# Altium schematic sheet controller_sch.SchDoc: controller sch
size 393 x 281 mm; Author: SAH; CompanyName: C3; DrawnBy: SAH; Engineer: SAH; DocumentNumber: 01
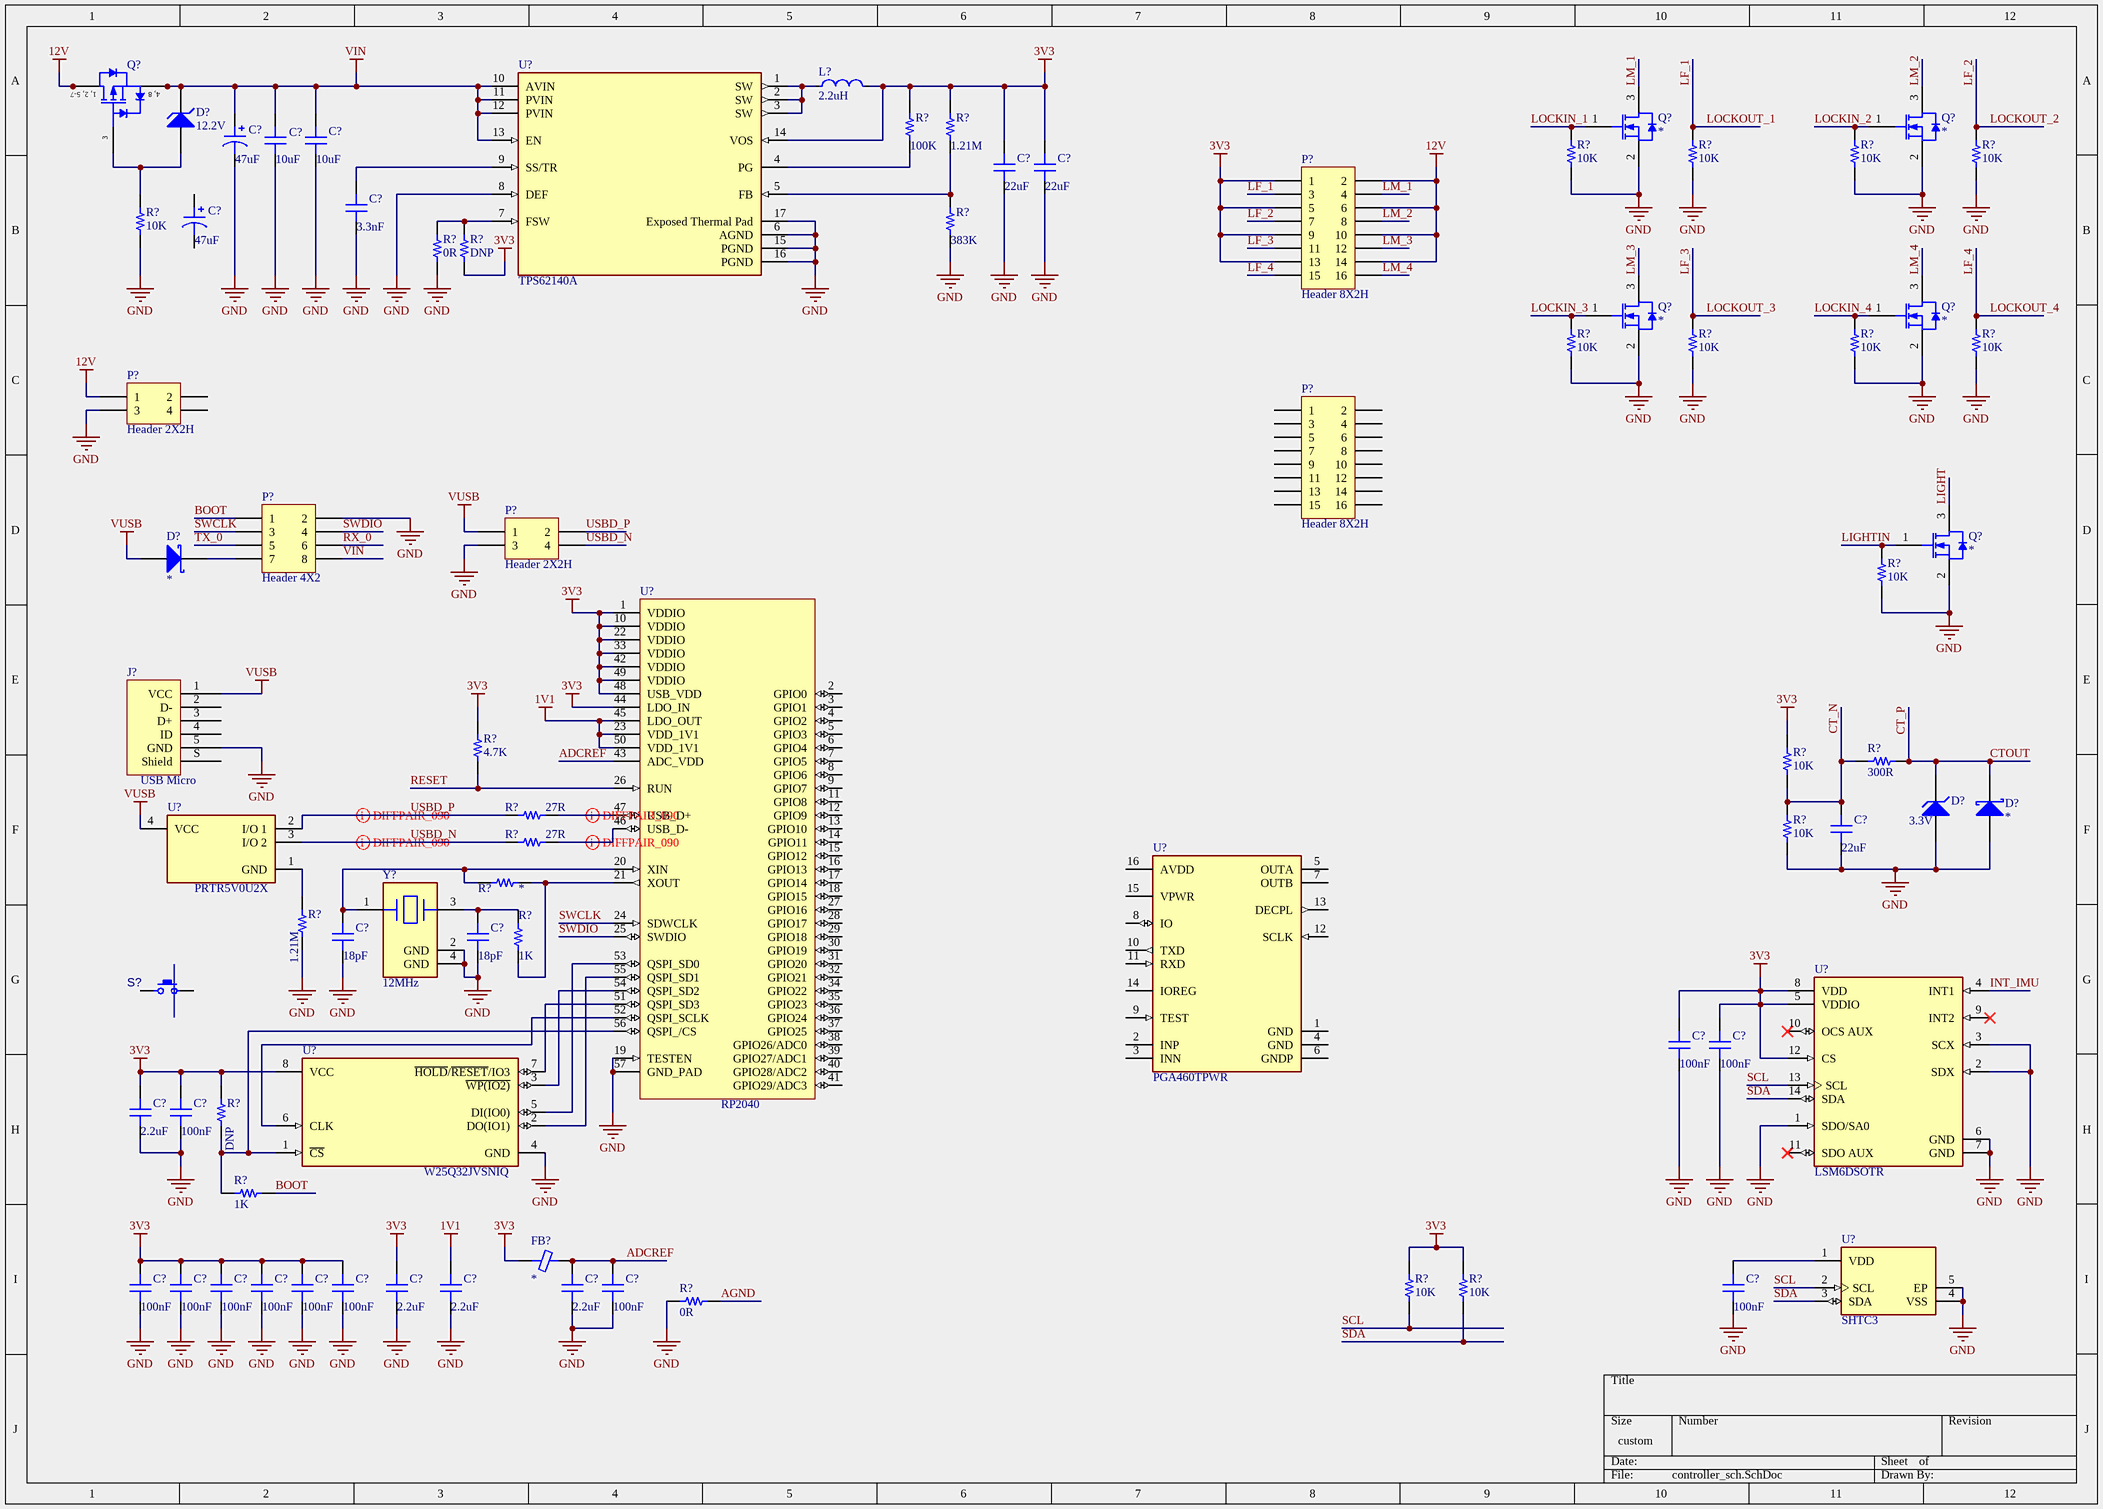
[diagram p0: controller_sch.SchDoc]

## Parts
(Parts that share a designator on the sheet are numbered #1, #2 ... from top to bottom, then left to right.)
C?#1  47uF  [CAP POL 2917_7343]
C?#2  10uF  [CAP 1210_3225 - 2.0MM]
C?#3  10uF  [CAP 1210_3225 - 2.0MM]
C?#4  22uF  [CAP 0805_2012]
C?#5  22uF  [CAP 0805_2012]
C?#6  3.3nF  [CAP 0603_1608]
C?#7  47uF  [CAP ALSMD 6.3MM H7.7MM]
C?#8  22uF  [CAP 0805_2012]
C?#9  18pF  [CAP 0603_1608]
C?#10  18pF  [CAP 0603_1608]
C?#11  100nF  [CAP 0603_1608]
C?#12  100nF  [CAP 0603_1608]
C?#13  2.2uF  [CAP 0603_1608]
C?#14  100nF  [CAP 0603_1608]
C?#15  100nF  [CAP 0603_1608]
C?#16  100nF  [CAP 0603_1608]
C?#17  100nF  [CAP 0603_1608]
C?#18  100nF  [CAP 0603_1608]
C?#19  100nF  [CAP 0603_1608]
C?#20  100nF  [CAP 0603_1608]
C?#21  2.2uF  [CAP 0603_1608]
C?#22  2.2uF  [CAP 0603_1608]
C?#23  2.2uF  [CAP 0603_1608]
C?#24  100nF  [CAP 0603_1608]
C?#25  100nF  [CAP 0603_1608]
D?#1  12.2V  [SOD-123-2]
D?#2  *  [Nexperia_SOD123W_0]
D?#3  3.3V  [ON_Semi_SOD-123F_0]
D?#4  *  [ON_Semi_SOD-123F_0]
FB?  *  [Murata_BLM18-0_15-t0_8_MFG]
J?  USB Micro  [FCI USB 10118193-0001LF]
L?  2.2uH  [Coilcraft_XFL4020_MFG]
P?#1  Header 8X2H  [Molex_2x8]
P?#2  Header 2X2H  [Molex_2x2]
P?#3  Header 8X2H  [Molex_2x8]
P?#4  Header 4X2  [HDR2X4]
P?#5  Header 2X2H  [Molex_2x2]
Q?#1  *  [ON SEMI SOT-23-3]
Q?#2  *  [ON SEMI SOT-23-3]
Q?#3  PMPB29XPE,115  [NXP-SOT1220_N]  (value not drawn)
Q?#4  *  [ON SEMI SOT-23-3]
Q?#5  *  [ON SEMI SOT-23-3]
Q?#6  *  [ON SEMI SOT-23-3]
R?#1  100K  [RES 0603_1608]
R?#2  1.21M  [RES 0603_1608]
R?#3  10K  [RES 0603_1608]
R?#4  10K  [RES 0603_1608]
R?#5  10K  [RES 0603_1608]
R?#6  10K  [RES 0603_1608]
R?#7  10K  [RES 0603_1608]
R?#8  383K  [RES 0603_1608]
R?#9  0R  [RES 0603_1608]
R?#10  DNP  [RES 0603_1608]
R?#11  10K  [RES 0603_1608]
R?#12  10K  [RES 0603_1608]
R?#13  10K  [RES 0603_1608]
R?#14  10K  [RES 0603_1608]
R?#15  10K  [RES 0603_1608]
R?#16  4.7K  [RES 0603_1608]
R?#17  10K  [RES 0603_1608]
R?#18  300R  [RES 1206_3216]
R?#19  27R  [RES 0603_1608]
R?#20  10K  [RES 0603_1608]
R?#21  27R  [RES 0603_1608]
R?#22  *  [RES 0603_1608]
R?#23  1.21M  [RES 0603_1608]
R?#24  1K  [RES 0603_1608]
R?#25  DNP  [RES 0603_1608]
R?#26  1K  [RES 0603_1608]
R?#27  10K  [RES 0603_1608]
R?#28  10K  [RES 0603_1608]
R?#29  0R  [RES 0603_1608]
S?  SPST-NO 4 PIN  [C&K_Components_PTS810_SJG_250_SMTR_LFS_MFG]  (value not drawn)
U?#1  TPS62140A  [Texas_Instruments_RGT0016C_MFG]
U?#2  RP2040  [RP2040-Footprint-1]
U?#3  PRTR5V0U2X  [Nexperia_SOT143B_MFG]
U?#4  PGA460TPWR  [PW0016A_MFG]
U?#5  LSM6DSOTR  [STMicroelectronics_LGA-14L-DM00249496_MFG]
U?#6  W25Q32JVSNIQ  [SPANSION SOIC-8 150mil Wide]
U?#7  SHTC3  [Sensirion_0_MFG]
Y?  value 12MHz  [Abracon_ABM8G_MFG]

## Nets
1V1: C?#22.1 U?#2.23(VDD_1V1) U?#2.45(LDO_OUT) U?#2.50(VDD_1V1)
3V3: C?#4.1 C?#5.1 C?#11.1 C?#12.1 C?#13.1 C?#14.1 C?#15.1 C?#16.1 C?#17.1 C?#18.1 C?#19.1 C?#20.1 C?#21.1 FB?.1 L?.2 P?#1.1 P?#1.5 P?#1.9 P?#1.13 R?#1.1 R?#2.1 R?#10.2 R?#16.2 R?#17.2 R?#25.1 R?#27.1 R?#28.1 U?#1.14(VOS) U?#2.1(VDDIO) U?#2.10(VDDIO) U?#2.22(VDDIO) U?#2.33(VDDIO) U?#2.42(VDDIO) U?#2.44(LDO_IN) U?#2.48(USB_VDD) U?#2.49(VDDIO) U?#5.5(VDDIO) U?#5.8(VDD) U?#5.12(CS) U?#6.8(VCC)
12V: P?#1.2 P?#1.6 P?#1.10 P?#1.14 P?#2.1 Q?#3.1(D) Q?#3.2(D) Q?#3.5(D) Q?#3.6(D) Q?#3.7(D)
GND: C?#1.2 C?#2.2 C?#3.2 C?#4.2 C?#5.2 C?#6.2 C?#8.2 C?#9.2 C?#10.2 C?#11.2 C?#12.2 C?#13.2 C?#14.2 C?#15.2 C?#16.2 C?#17.2 C?#18.2 C?#19.2 C?#20.2 C?#21.2 C?#22.2 C?#23.2 C?#24.2 C?#25.2 D?#3.2(A) D?#4.2(A) J?.5(GND) P?#2.3 P?#4.2 P?#5.3 Q?#1.2(S) Q?#2.2(S) Q?#4.2(S) Q?#5.2(S) Q?#6.2(S) R?#3.2 R?#4.2 R?#5.2 R?#6.2 R?#7.2 R?#8.2 R?#9.2 R?#11.2 R?#12.2 R?#13.2 R?#14.2 R?#15.2 R?#20.1 R?#23.2 R?#29.1 U?#1.6(AGND) U?#1.8(DEF) U?#1.15(PGND) U?#1.16(PGND) U?#1.17(Exposed_Thermal_Pad) U?#2.19(TESTEN) U?#2.57(GND_PAD) U?#5.1(SDO/SA0) U?#5.2(SDX) U?#5.3(SCX) U?#5.6(GND) U?#5.7(GND) U?#6.4(GND) U?#7.4(VSS) U?#7.5(EP) Y?.2(GND) Y?.4(GND)
VIN: C?#1.1 C?#2.1 C?#3.1 D?#1.1(K) P?#4.8 Q?#3.4(S) Q?#3.8(S) U?#1.10(AVIN) U?#1.11(PVIN) U?#1.12(PVIN) U?#1.13(EN)
VUSB: D?#2.2(A) J?.1(VCC) P?#5.1 U?#3.4(VCC)
ADCREF: C?#23.1 C?#24.1 FB?.2 U?#2.43(ADC_VDD)
AGND: R?#29.2
BOOT: P?#4.1 R?#26.1
CT_N: C?#8.1 R?#17.1 R?#18.2 R?#20.2
CT_P: D?#3.1(K) D?#4.1(K) R?#18.1  [also labelled CTOUT]
INT_IMU: U?#5.4(INT1)
LF_1: P?#1.3 R?#4.1  [also labelled LOCKOUT_1]
LF_2: P?#1.7 R?#6.1  [also labelled LOCKOUT_2]
LF_3: P?#1.11 R?#12.1  [also labelled LOCKOUT_3]
LF_4: P?#1.15 R?#14.1  [also labelled LOCKOUT_4]
LIGHT: Q?#6.3(D)
LIGHTIN: Q?#6.1(G) R?#15.1
LM_1: P?#1.4 Q?#1.3(D)
LM_2: P?#1.8 Q?#2.3(D)
LM_3: P?#1.12 Q?#4.3(D)
LM_4: P?#1.16 Q?#5.3(D)
LOCKIN_1: Q?#1.1(G) R?#3.1
LOCKIN_2: Q?#2.1(G) R?#5.1
LOCKIN_3: Q?#4.1(G) R?#11.1
LOCKIN_4: Q?#5.1(G) R?#13.1
RESET: R?#16.1 U?#2.26(RUN)
RX_0: P?#4.6
SCL: R?#27.2 U?#5.13(SCL) U?#7.2(SCL)
SDA: R?#28.2 U?#5.14(SDA) U?#7.3(SDA)
SWCLK: P?#4.3 U?#2.24(SDWCLK)
SWDIO: P?#4.4 U?#2.25(SWDIO)
TX_0: P?#4.5
USBD_N: P?#5.4 R?#21.1 U?#3.3(I/O_2)
USBD_P: P?#5.2 R?#19.1 U?#3.2(I/O_1)
NetC?#6_1: C?#6.1 U?#1.9(SS/TR)
NetC?#9_1: C?#9.1 R?#22.1 U?#2.20(XIN) Y?.1
NetC?#10_1: C?#10.1 R?#24.1 Y?.3
NetC?#25_1: C?#25.1 U?#7.1(VDD)
NetD?#1_2: D?#1.2(A) Q?#3.3(G) R?#7.1
NetD?#2_1: D?#2.1(K) P?#4.7
NetL?_1: L?.1 U?#1.1(SW) U?#1.2(SW) U?#1.3(SW)
NetR?#1_2: R?#1.2 U?#1.4(PG)
NetR?#2_2: R?#2.2 R?#8.1 U?#1.5(FB)
NetR?#9_1: R?#9.1 R?#10.1 U?#1.7(FSW)
NetR?#19_2: R?#19.2 U?#2.47(USB_D+)
NetR?#21_2: R?#21.2 U?#2.46(USB_D-)
NetR?#22_2: R?#22.2 R?#24.2 U?#2.21(XOUT)
NetR?#23_1: R?#23.1 U?#3.1(GND)
NetR?#25_2: R?#25.2 R?#26.2 U?#2.56(QSPI_/CS) U?#6.1(~{CS})
NetS?_1: S?.1(P1) S?.2(P2)
NetS?_3: S?.3(P3) S?.4(P4)
NetU?#2_51: U?#2.51(QSPI_SD3) U?#6.7(~{HOLD}/~{RESET}/IO3)
NetU?#2_52: U?#2.52(QSPI_SCLK) U?#6.6(CLK)
NetU?#2_53: U?#2.53(QSPI_SD0) U?#6.5(DI(IO0))
NetU?#2_54: U?#2.54(QSPI_SD2) U?#6.3(~{WP(IO2)})
NetU?#2_55: U?#2.55(QSPI_SD1) U?#6.2(DO(IO1))

Not connected (* = marked no-connect by the designer): C?#7 1 2; J? 2(D-) 3(D+) 4(ID) S(Shield); P?#2 2 4; P?#3 1 2 3 4 5 6 7 8 9 10 11 12 13 14 15 16; U?#2 2(GPIO0) 3(GPIO1) 4(GPIO2) 5(GPIO3) 6(GPIO4) 7(GPIO5) 8(GPIO6) 9(GPIO7) 11(GPIO8) 12(GPIO9) 13(GPIO10) 14(GPIO11) 15(GPIO12) 16(GPIO13) 17(GPIO14) 18(GPIO15) 27(GPIO16) 28(GPIO17) 29(GPIO18) 30(GPIO19) 31(GPIO20) 32(GPIO21) 34(GPIO22) 35(GPIO23) 36(GPIO24) 37(GPIO25) 38(GPIO26/ADC0) 39(GPIO27/ADC1) 40(GPIO28/ADC2) 41(GPIO29/ADC3); U?#4 1(GND) 2(INP) 3(INN) 4(GND) 5(OUTA) 6(GNDP) 7(OUTB) 8(IO) 9(TEST) 10(TXD) 11(RXD) 12(SCLK) 13(DECPL) 14(IOREG) 15(VPWR) 16(AVDD); U?#5 9(INT2)* 10(OCS_AUX)* 11(SDO_AUX)*

## Layout directives
differential pair; differential pair class DIFFPAIR_090; rule Differential Pairs Routing [Pref Gap = 0.153mm    Min Gap  = 0.153mm    Max Gap  = 0.153mmPref Width = 0.75mm    Min Width  = 0.75mm    Max Width  = 0.75mm]: USBD_P
differential pair; differential pair class DIFFPAIR_091; rule Differential Pairs Routing [Pref Gap = 0.153mm    Min Gap  = 0.153mm    Max Gap  = 0.153mmPref Width = 0.75mm    Min Width  = 0.75mm    Max Width  = 0.75mm]: USBD_N
differential pair; differential pair class DIFFPAIR_092; rule Differential Pairs Routing [Pref Gap = 0.153mm    Min Gap  = 0.153mm    Max Gap  = 0.153mmPref Width = 0.75mm    Min Width  = 0.75mm    Max Width  = 0.75mm]: NetR?#21_2
differential pair; differential pair class DIFFPAIR_093; rule Differential Pairs Routing [Pref Gap = 0.153mm    Min Gap  = 0.153mm    Max Gap  = 0.153mmPref Width = 0.75mm    Min Width  = 0.75mm    Max Width  = 0.75mm]: NetR?#19_2

## Notes on the sheet
- Title
- Size:
- Date:
- A3
- Number:
- Time:
- Revision:
- Sheet
- of
- File:
- (in symbol Mosfet-P-2) 1, 2, 5-7; 4, 8

## Library data of the parts
C?#1 C?#7 = Polarised Capacitor: SMT Polarised Capacitor; MF: *; MP: *; Value: 47uF
C?#2-C?#6 C?#8-C?#25 = Capacitor: SMT Capacitor; MF: *; MP: *
  C?#2 C?#3: Value: 10uF
  C?#4 C?#5 C?#8: Value: 22uF
  C?#6: Value: 3.3nF
  C?#9 C?#10: Value: 18pF
  C?#11 C?#12 C?#14-C?#20 C?#24 C?#25: Value: 100nF
  C?#13 C?#21-C?#23: Value: 2.2uF
D?#1 = Zener Diode: Zener Voltage Regulator; Manufacturer: On Semiconductor; Packing: Tape and Reel; P Max (W): 0.5; VZ Typ (V): 4.7; ComponentLink1Description: Manufacturer URL; ComponentLink2Description: Datasheet; DatasheetVersion: Rev. 12; ComponentLink3URL: http://www.onsemi.com/pub_link/Collateral/425-04.PDF; ComponentLink3Description: Package Specification; ComponentLink1URL: http://www.onsemi.com/; ComponentLink2URL: http://www.onsemi.com/pub_link/Collateral/MMSZ5221BT1-D.PDF; PackageVersion: Rev. G, 10/2009; PackageReference: SOD-123-2-425-04; PackageDescription: 2-Pin SOD, Body 1.6 x 2.69 mm; Mounting Technology: Surface Mount; RoHS: Pb-Free; MF: *; MP: *; Value: 12.2V
D?#2 = Schottky Diode: Schottky Barrier Rectifier, 40 V Maximum DC Blocking Voltage, -65 to 125 degC, 2-Pin SMA Case, RoHS; ComponentLink1Description: Manufacturer URL; ComponentLink2Description: Datasheet; MF: *; ComponentLink3URL: http://www.vishay.com/docs/88746/ss12.pdf; ComponentLink3Description: Package Specification; ComponentLink1URL: http://www.vishay.com/; ComponentLink2URL: http://www.vishay.com/docs/88746/ss12.pdf; MP: *; Value: *
D?#3 = Zener Diode: Zener Voltage Regulator; Manufacturer: On Semiconductor; Packing: Tape and Reel; P Max (W): 0.5; VZ Typ (V): 4.7; MF: Nexperia; MP: NZH3V3A,115; ComponentLink1Description: Manufacturer URL; ComponentLink2Description: Datasheet; DatasheetVersion: Rev. 12; ComponentLink3URL: http://www.onsemi.com/pub_link/Collateral/425-04.PDF; ComponentLink3Description: Package Specification; ComponentLink1URL: http://www.onsemi.com/; ComponentLink2URL: http://www.onsemi.com/pub_link/Collateral/MMSZ5221BT1-D.PDF; PackageVersion: Rev. G, 10/2009; PackageReference: SOD-123-2-425-04; PackageDescription: 2-Pin SOD, Body 1.6 x 2.69 mm; Mounting Technology: Surface Mount; RoHS: Pb-Free; Value: 3.3V
D?#4 = Schottky Diode: Schottky Barrier Rectifier, 40 V Maximum DC Blocking Voltage, -65 to 125 degC, 2-Pin SMA Case, RoHS; MF: Nexperia; MP: PMEG2010AEH,115; ComponentLink1Description: Manufacturer URL; ComponentLink2Description: Datasheet; ComponentLink3URL: http://www.vishay.com/docs/88746/ss12.pdf; ComponentLink3Description: Package Specification; ComponentLink1URL: http://www.vishay.com/; ComponentLink2URL: http://www.vishay.com/docs/88746/ss12.pdf; Value: *
FB? = Ferrite Chip: SMT Ferrite Chip; MF: *; MP: *; Value: *
J? = USB 2.0 Type B Micro: MP: 10118194-0001LF; MF: Amphenol FCI
L? = Inductor_sm: Fixed Inductors 2.2uH 20% High Temp AEC-Q200; MF: *; MP: *; Value: 2.2uH
P?#1 P?#3 = Header 8X2H: Header, 8-Pin, Dual row, Right Angle; LatestRevisionDate: 17-Jul-2002; LatestRevisionNote: Re-released for DXP Platform.; Publisher: Altium Limited
P?#2 P?#5 = Header 2X2H: Header, 2-Pin, Dual row, Right Angle; LatestRevisionDate: 17-Jul-2002; LatestRevisionNote: Re-released for DXP Platform.; Publisher: Altium Limited
P?#4 = Header 4X2: Header, 4-Pin, Dual row; LatestRevisionDate: 17-Jul-2002; LatestRevisionNote: Re-released for DXP Platform.; Publisher: Altium Limited
Q?#1 Q?#2 Q?#4-Q?#6 = Mosfet-N: N-Channel Enhancement Mode MOS Transistor, 30 V, 0.85 A, 3-Pin SOT23, Tape and Reel; Coss [typ] (pF): 27; Ciss [typ] (pF): 83; Channel Type: N; Packing: Tape & Reel; ID [max] (A): 0.85; VDS [max] (V): 30; ComponentLink1Description: Manufacturer URL; ComponentLink2Description: Datasheet; ComponentLink3Description: Package Specification; ComponentLink3URL: http://www.nxp.com/documents/outline_drawing/sot023_po.pdf; ComponentLink1URL: http://www.nxp.com/; ComponentLink2URL: http://www.nxp.com/documents/data_sheet/BSH103.pdf; PackageReference: SOT23; Code_JEDEC: TO-236AB; Mounting Technology: Surface Mount; PackageDescription: 3-Pin Small Outline Transistor Package, Body 2.9 x 1.3 mm, Pitch 0.95 mm; PackageVersion: 06-03-16, 03/2006; MF: *; MP: *; Value: *
Q?#3 = Mosfet-P-2: Single P-Channel Trench MOSFET, -20 V, -5 A, -55 to 150 degC, 8-Pin SOT1220, Reel; Ciss [typ] (pF): 2970; Coss [typ] (pF): 245; VGSth [typ] (V): -0.68; Channel Type: P; MF: NXP Semiconductors; ComponentLink1Description: Manufacturer URL; ComponentLink2Description: Datasheet; MP: PMPB29XPE,115; DatasheetVersion: Rev. 1; ComponentLink3URL: http://www.nxp.com/documents/outline_drawing/sot1220_po.pdf; ComponentLink1URL: http://www.nxp.com/; ComponentLink2URL: http://www.nxp.com/documents/data_sheet/PMPB29XPE.pdf; PackageReference: SOT1220; ID [max] (A): -5; Packing: Reel; ComponentLink3Description: Package Specification; Mounting Technology: Surface Mount; VDS [max] (V): -20; PackageDescription: 6-Pin Small Outline No-Lead, Body 2 x 2 mm, Pitch 0.65 mm; PackageVersion: 12-04-30, 04/2012; Value: PMPB29XPE,115
R?#1-R?#29 = Resistor: SMT Resistor; MF: *; MP: *
  R?#1: Value: 100K
  R?#2 R?#23: Value: 1.21M
  R?#3-R?#7 R?#11-R?#15 R?#17 R?#20 R?#27 R?#28: Value: 10K
  R?#8: Value: 383K
  R?#9 R?#29: Value: 0R
  R?#10 R?#25: Value: DNP
  R?#16: Value: 4.7K
  R?#18: Value: 300R
  R?#19 R?#21: Value: 27R
  R?#22: Value: *
  R?#24 R?#26: Value: 1K
S? = SPST-NO 4 PIN: SWITCH, PUSH BUTTON, TACTILE, SMD, SPST; MANF: OMRON; DESC: DESCRIPTION; MANF_P#: B3U-1000P; VALUE: PUSHBUTTON; ASSEMBLY: ASSEMBLY; PARAM: PARAM; PRICE: 1$
U?#1 = TPS62140A: Switching Voltage Regulators 3-V to 17-V, 2-A, high-efficiency and low IQ buck converter 3mm x 3mm QFN package; MF: Texas Instruments; MP: TPS62140ARGTT
U?#2 = RP2040: ARM® Cortex®-M0+ series Microcontroller IC 32-Bit Dual-Core 133MHz 16MB (16M x 8) FLASH 56-QFN (7x7); MF: Raspberry Pi; MP: RP2040TR13
U?#3 = PRTR5V0U2X: IC TVS DIODE 5.5VWM SOT143B; MF: Nexperia; helpURL: https://upverter.com/upn/revision/7499e15ef6437a79/; ComponentLink2Description: Datasheet; Temperature: −40°C to +85°C; Package: SOT143B; Supplier 2: Mouser; Supplier 1: Digi-Key; ComponentLink1URL: https://upverter.com/upn/revision/7499e15ef6437a79/; Supplier Part Number 2: 771-PRTR5V0U2X-T/R; Supplier Part Number 1: 1727-3884-1-ND; ComponentLink1Description: Upverter; ComponentLink2URL: https://assets.nexperia.com/documents/data-sheet/PRTR5V0U2X.pdf; RoHS: TRUE; Mouser Part Number: 771-PRTR5V0U2X-T/R; Digikey Description: IC TVS DIODE 5.5VWM SOT143B; Digikey Part Number: 1727-3884-1-ND; Lead Free: yes; Temperature Range Low: −40°C; Temperature Range High: +85°C; MP: PRTR5V0U2X
U?#4 = PGA460TPWR: Ultrasonic signal processor and transducer driver 16-TSSOP -40 to 105; MF: Texas Instruments; MP: PGA460TPWR
U?#5 = LSM6DSOTR: Inertial Measurement Unit, 6-axis, I2C, SPI, 1.7V-3.6V; MF: STMicroelectronics; MP: LSM6DSOTR
U?#6 = W25Q32JVSNIQ: 3V 32M-BIT / SERIAL FLASH MEMORY WITH / DUAL, QUAD SPI; MF: Winbond; MP: W25Q32JVSNIQ
U?#7 = SHTC3: Board Mount Humidity Sensors Humidity and Temperature Sensor; MF: Sensirion; MP: SHTC3
Y? = ABM8G: Crystals AEC-Q200 CRYSTAL 12.000MHZ 18PF SMD; MR: ABRACON; MP: ABM8AIG-12.000MHZ-4-T